# EAGLE schematic master-v10 (EAGLE 6.5.0)
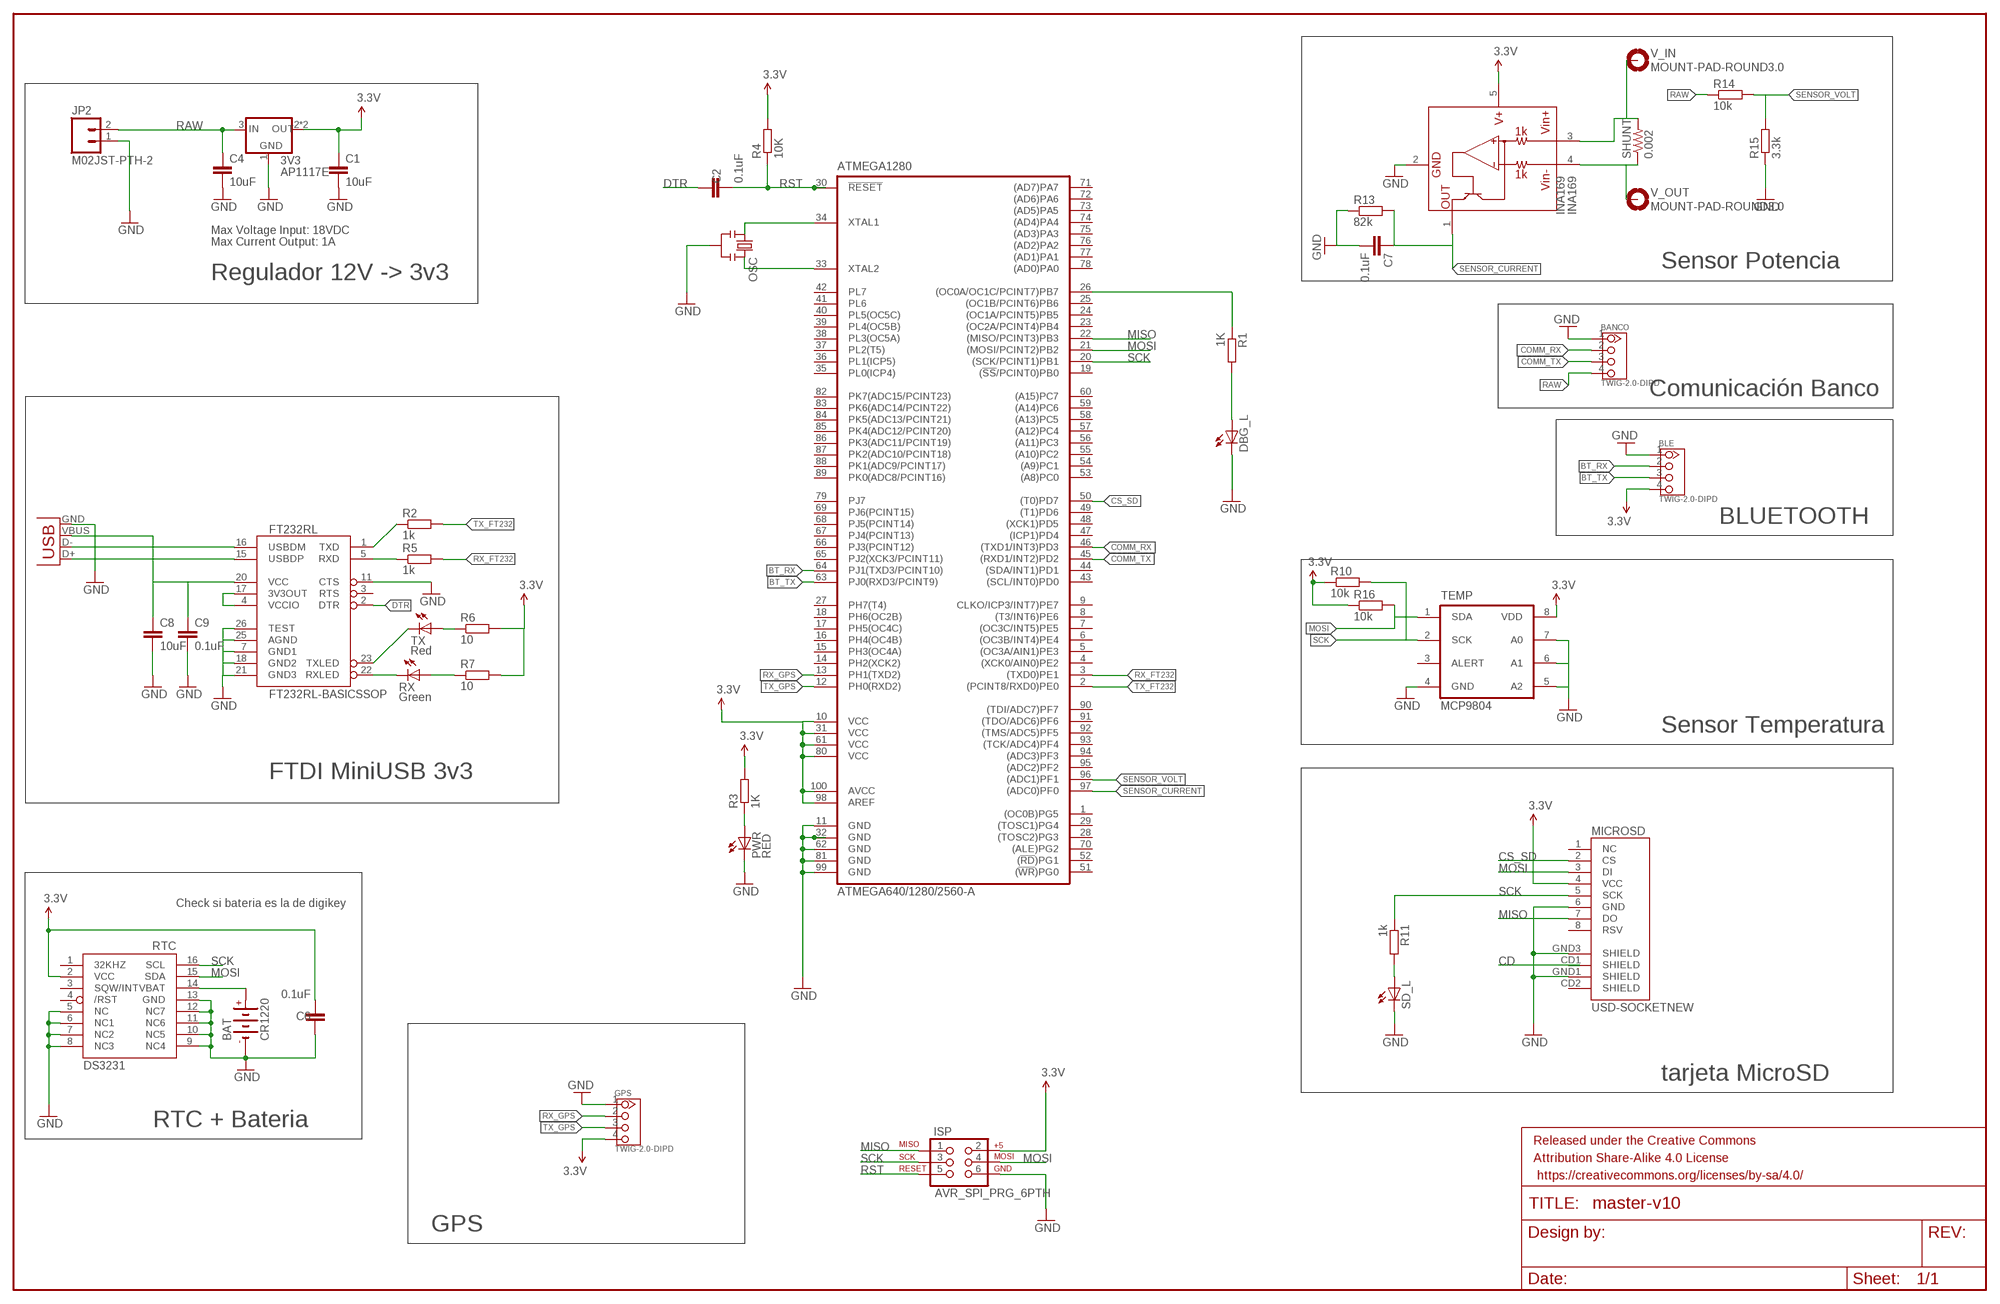
[diagram p0: schematic, sheet 1]

## Parts
3V3  AP1117E  [SOT223]
ATMEGA1280  ATMEGA640/1280/2560-A  [TQFP100A]
BANCO  TWIG-2.0-DIPD  [2.0_1X4_90]
BAT  CR1220  [CR1220]
BLE  TWIG-2.0-DIPD  [2.0_1X4_90]
C1  10uF  C-EUC0805K  [C0805K]
C2  0.1uF  C-EUC0805K  [C0805K]
C4  10uF  C-EUC0805K  [C0805K]
C6  0.1uF  C-EUC0805K  [C0805K]
C7  0.1uF  C-EUC0805K  [C0805K]
C8  10uF  C-EUC1206K  [C1206K]
C9  0.1uF  C-EUC0805K  [C0805K]
DBG_L  LEDCHIPLED_0805  [CHIPLED_0805]
FRAME1  FRAME-LEDGER  [CREATIVE_COMMONS]
FT232RL  FT232RL-BASICSSOP  [SSOP28DB]
GPS  TWIG-2.0-DIPD  [2.0_1X4_90]
INA169  INA169  [SOT23-5]
ISP  AVR_SPI_PRG_6PTH  [2X3]
JP1  USB-MB-H  [USB-MB-H]
JP2  M02JST-PTH-2  [JST-2-PTH]
MICROSD  USD-SOCKETNEW  [MICRO-SD-SOCKET-PP]
OSC  RESONATOR-SMD  [RESONATOR-SMD]
PWR  RED  LEDCHIPLED_0805  [CHIPLED_0805]
R1  1K  R-EU_R0805  [R0805]
R2  1k  R-EU_R0805  [R0805]
R3  1K  R-EU_R0805  [R0805]
R4  10K  R-EU_R0805  [R0805]
R5  1k  R-EU_R0805  [R0805]
R6  10  R-EU_R0805  [R0805]
R7  10  R-EU_R0805  [R0805]
R10  10k  R-EU_R0805  [R0805]
R11  1k  R-EU_R0805  [R0805]
R13  82k  R-EU_R0805  [R0805]
R14  10k  R-EU_R0805  [R0805]
R15  3.3k  R-EU_R0805  [R0805]
R16  10k  R-EU_R0805  [R0805]
RTC  DS3231/SO  [SO16W]
RX  Green  LEDSML0805  [SML0805]
SD_L  LEDCHIPLED_0805  [CHIPLED_0805]
SHUNT  0.002  RESISTOR1206  [1206]
TEMP  MCP9804  [MSOP8]
TX  Red  LEDSML0805  [SML0805]
V_IN  MOUNT-PAD-ROUND3.0  [3,0-PAD]
V_OUT  MOUNT-PAD-ROUND3.0  [3,0-PAD]

## Nets
3.3V: 3V3.2(OUT) 3V3.4(OUT) ATMEGA1280.10(VCC) ATMEGA1280.31(VCC) ATMEGA1280.61(VCC) ATMEGA1280.80(VCC) ATMEGA1280.98(AREF) ATMEGA1280.100(AVCC) BLE.4 C1.1 C6.1 GPS.4 INA169.5(V+) ISP.2 MICROSD.4(VCC) R3.2 R4.2 R6.2 R7.2 R10.1 R16.1 RTC.2(VCC) TEMP.8(VDD)
BT_RX: ATMEGA1280.64(PJ1(TXD3/PCINT10)) BLE.2
BT_TX: ATMEGA1280.63(PJ0(RXD3/PCINT9)) BLE.3
COMM_RX: ATMEGA1280.46((TXD1/INT3)PD3) BANCO.2
COMM_TX: ATMEGA1280.45((RXD1/INT2)PD2) BANCO.3
CS_SD: ATMEGA1280.50((T0)PD7) MICROSD.2(CS)
DTR: C2.2 FT232RL.2(DTR)
GND [vcc]: 3V3.1(GND) ATMEGA1280.11(GND) ATMEGA1280.32(GND) ATMEGA1280.62(GND) ATMEGA1280.81(GND) ATMEGA1280.99(GND) BANCO.1 BAT.- BLE.1 C1.2 C4.2 C6.2 C7.2 C8.2 C9.2 DBG_L.C FT232RL.7(GND1) FT232RL.11(CTS) FT232RL.18(GND2) FT232RL.21(GND3) FT232RL.25(AGND) FT232RL.26(TEST) GPS.1 INA169.2(GND) ISP.6 JP1.GND JP2.1 MICROSD.6(GND) MICROSD.GND1(SHIELD) MICROSD.GND3(SHIELD) OSC.2 PWR.C R13.1 R15.1 RTC.5(NC) RTC.6(NC1) RTC.7(NC2) RTC.8(NC3) RTC.9(NC4) RTC.10(NC5) RTC.11(NC6) RTC.12(NC7) RTC.13(GND) SD_L.C TEMP.4(GND) TEMP.5(A2) TEMP.6(A1) TEMP.7(A0)
MISO: ATMEGA1280.22((MISO/PCINT3)PB3) ISP.1 MICROSD.7(DO)
MOSI: ATMEGA1280.21((MOSI/PCINT2)PB2) ISP.4 MICROSD.3(DI) R16.2 RTC.15(SDA) TEMP.1(SDA)
N$1: BAT.+ RTC.14(VBAT)
N$2: ATMEGA1280.34(XTAL1) OSC.1
N$3: DBG_L.A R1.2
N$4: ATMEGA1280.26((OC0A/OC1C/PCINT7)PB7) R1.1
N$5: FT232RL.15(USBDP) JP1.D+
N$6: FT232RL.1(TXD) R2.1
N$7: PWR.A R3.1
N$8: FT232RL.5(RXD) R5.1
N$10: FT232RL.22(RXLED) RX.C
N$11: R7.1 RX.A
N$12: FT232RL.23(TXLED) TX.C
N$13: R6.1 TX.A
N$14: ATMEGA1280.33(XTAL2) OSC.3
N$19: FT232RL.16(USBDM) JP1.D-
N$23: R11.2 SD_L.A
N$24: C8.1 C9.1 FT232RL.20(VCC) JP1.VBUS
N$25: FT232RL.4(VCCIO) FT232RL.17(3V3OUT)
RAW [vcc]: 3V3.3(IN) BANCO.4 C4.1 JP2.2 R14.1
RST: ATMEGA1280.30(!RESET!) C2.1 ISP.5 R4.1
RX_FT232: ATMEGA1280.3((TXD0)PE1) R5.2
RX_GPS: ATMEGA1280.13(PH1(TXD2)) GPS.2
SCK: ATMEGA1280.20((SCK/PCINT1)PB1) ISP.3 MICROSD.5(SCK) R10.2 R11.1 RTC.16(SCL) TEMP.2(SCK)
SENSOR_CURRENT: ATMEGA1280.97((ADC0)PF0) C7.1 INA169.1(OUT) R13.2
SENSOR_VOLT: ATMEGA1280.96((ADC1)PF1) R14.2 R15.2
TX_FT232: ATMEGA1280.2((PCINT8/RXD0)PE0) R2.2
TX_GPS: ATMEGA1280.12(PH0(RXD2)) GPS.3
VIN+: INA169.3(VIN+) SHUNT.2 V_IN.B3,0(MOUNT)
VIN-: INA169.4(VIN-) SHUNT.1 V_OUT.B3,0(MOUNT)
Unconnected: ATMEGA1280.1((OC0B)PG5) ATMEGA1280.4((XCK0/AIN0)PE2) ATMEGA1280.5((OC3A/AIN1)PE3) ATMEGA1280.6((OC3B/INT4)PE4) ATMEGA1280.7((OC3C/INT5)PE5) ATMEGA1280.8((T3/INT6)PE6) ATMEGA1280.9(CLKO/ICP3/INT7)PE7) ATMEGA1280.14(PH2(XCK2)) ATMEGA1280.15(PH3(OC4A)) ATMEGA1280.16(PH4(OC4B)) ATMEGA1280.17(PH5(OC4C)) ATMEGA1280.18(PH6(OC2B)) ATMEGA1280.19((!SS!/PCINT0)PB0) ATMEGA1280.23((OC2A/PCINT4)PB4) ATMEGA1280.24((OC1A/PCINT5)PB5) ATMEGA1280.25((OC1B/PCINT6)PB6) ATMEGA1280.27(PH7(T4)) ATMEGA1280.28((TOSC2)PG3) ATMEGA1280.29((TOSC1)PG4) ATMEGA1280.35(PL0(ICP4)) ATMEGA1280.36(PL1(ICP5)) ATMEGA1280.37(PL2(T5)) ATMEGA1280.38(PL3(OC5A)) ATMEGA1280.39(PL4(OC5B)) ATMEGA1280.40(PL5(OC5C)) ATMEGA1280.41(PL6) ATMEGA1280.42(PL7) ATMEGA1280.43((SCL/INT0)PD0) ATMEGA1280.44((SDA/INT1)PD1) ATMEGA1280.47((ICP1)PD4) ATMEGA1280.48((XCK1)PD5) ATMEGA1280.49((T1)PD6) ATMEGA1280.51((!WR!)PG0) ATMEGA1280.52((!RD!)PG1) ATMEGA1280.53((A8)PC0) ATMEGA1280.54((A9)PC1) ATMEGA1280.55((A10)PC2) ATMEGA1280.56((A11)PC3) ATMEGA1280.57((A12)PC4) ATMEGA1280.58((A13)PC5) ATMEGA1280.59((A14)PC6) ATMEGA1280.60((A15)PC7) ATMEGA1280.65(PJ2(XCK3/PCINT11)) ATMEGA1280.66(PJ3(PCINT12)) ATMEGA1280.67(PJ4(PCINT13)) ATMEGA1280.68(PJ5(PCINT14)) ATMEGA1280.69(PJ6(PCINT15)) ATMEGA1280.70((ALE)PG2) ATMEGA1280.71((AD7)PA7) ATMEGA1280.72((AD6)PA6) ATMEGA1280.73((AD5)PA5) ATMEGA1280.74((AD4)PA4) ATMEGA1280.75((AD3)PA3) ATMEGA1280.76((AD2)PA2) ATMEGA1280.77((AD1)PA1) ATMEGA1280.78((AD0)PA0) ATMEGA1280.79(PJ7) ATMEGA1280.82(PK7(ADC15/PCINT23)) ATMEGA1280.83(PK6(ADC14/PCINT22)) ATMEGA1280.84(PK5(ADC13/PCINT21)) ATMEGA1280.85(PK4(ADC12/PCINT20)) ATMEGA1280.86(PK3(ADC11/PCINT19)) ATMEGA1280.87(PK2(ADC10/PCINT18)) ATMEGA1280.88(PK1(ADC9/PCINT17)) ATMEGA1280.89(PK0(ADC8/PCINT16)) ATMEGA1280.90((TDI/ADC7)PF7) ATMEGA1280.91((TDO/ADC6)PF6) ATMEGA1280.92((TMS/ADC5)PF5) ATMEGA1280.93((TCK/ADC4)PF4) ATMEGA1280.94((ADC3)PF3) ATMEGA1280.95((ADC2)PF2) FT232RL.3(RTS) MICROSD.1(NC) MICROSD.8(RSV) MICROSD.CD1(SHIELD) MICROSD.CD2(SHIELD) RTC.1(32KHZ) RTC.3(SQW/INT) RTC.4(/RST) TEMP.3(ALERT)

## Notes on the sheet
- Max Voltage Input: 18VDC
- Max Current Output: 1A
- Sensor Potencia
- Regulador 12V -> 3v3
- Comunicación Banco
- BLUETOOTH
- Sensor Temperatura
- FTDI MiniUSB 3v3
- Check si bateria es la de digikey
- tarjeta MicroSD
- RTC + Bateria
- GPS

## Library data of the parts
3V3 = v-reg:AP1117: LDO Regulator
ATMEGA1280 = atmel-avr:ATMEGA640/1280/2560: MICROCONTROLLER 64K/128K/256K Flash 8K Bytes Internal SRAM 4K Bytes EEPROM
BANCO BLE GPS = Grove :TWIG-2.0-DIP
BAT = battery:CR1220: LI BATTERY Panasonic
C1 C2 C4 C6-C9 = rcl:C-EU: CAPACITOR, European symbol
DBG_L PWR SD_L = adafruit:LED: LED
FRAME1 = SparkFun-Aesthetics:FRAME-LEDGER: Schematic Frame Standard 11x14 US Ledger frame
FT232RL = SparkFun-DigitalIC:FT232RL-BASIC: USB UART This is the simplified version of the FT232RL unit. Only what you need, nothing you don't. Spark Fun Electronics SKU : COM-00650
INA169 = SparkFun-AnalogIC:INA169
ISP = SparkFun-Connectors:AVR_SPI_PRG_6: AVR ISP 6 Pin This is the reduced ISP connector for AVR programming. Common on Arduino. This footprint will take up less PCB space and can be used with a 10-pin to 6-pin adapter such as SKU: BOB-08508
JP1 = SparkFun-Connectors:USB: USB Connectors USB-B-PTH is fully proven SKU : PRT-00139/CONN-08278 USB-miniB is fully proven SKU : PRT-00587 USB-A-PCB is untested. USB-A-H is throughly reviewed, but untested. Spark Fun Electronics SKU : PRT-00437 USB-B-SMT is throughly reviewed, but untested. Needs silkscreen touching up. USB-A-S has not been used/tested USB-MB-H has not been used/tested USB-MICROB has been used. CONN-09505
JP2 = SparkFun-Connectors:M02: Standard 2-pin 0.1" header. Use with - straight break away headers ( PRT-00116) - right angle break away headers (PRT-00553) - swiss pins (PRT-00743) - machine pins (PRT-00117) - female headers (PRT-00115) Molex polarized connector foot print use with: PRT-08233 with associated crimp pins and housings. 2.54_SCREWTERM for use with PRT-10571. 3.5mm Screw Terminal footprints for PRT-08084 5mm Screw Terminal footprints for use with PRT-08433; SKU: PRT-09914
MICROSD = SparkFun-Connectors:USD-SOCKET: microSD Socket Push-push type uSD socket. Schematic element and footprint production proven. Spark Fun Electronics SKU : PRT-00127. tDoc lines correctly indicate media card edge positions when inserting (unlocked, locked, depressed).
OSC = resonador:RESONATOR-: Resonator Small SMD resonator. This is the itty bitty 10/20MHz resonators with built in caps. CSTCE10M0G55 and CSTCE20M0V53. Footprint has been reviewed closely but hasn't been tested yet.
R1-R7 R10 R11 R13-R16 = rcl:R-EU_: RESISTOR, European symbol
RTC = adafruit:DS3231
RX TX = led:LED: LED
SHUNT = SparkFun-Resistors:RESISTOR: Resistor Basic schematic elements and footprints for 0603, 1206, and PTH resistors.
TEMP = MCP9804:MCP9804: TEMP SENSOR
V_IN V_OUT = holes:MOUNT-PAD-ROUND: MOUNTING PAD, round

## Net classes
0 default: width 0.178 mm
1 vcc: width 0.203 mm